# Altium schematic sheet eVV_Power Supply.SchDoc: eVV_Power Supply Block Diagram
size A4; DrawnBy: Ivica Matovic; Revision: 1.1; SheetNumber: 4; SheetTotal: 8
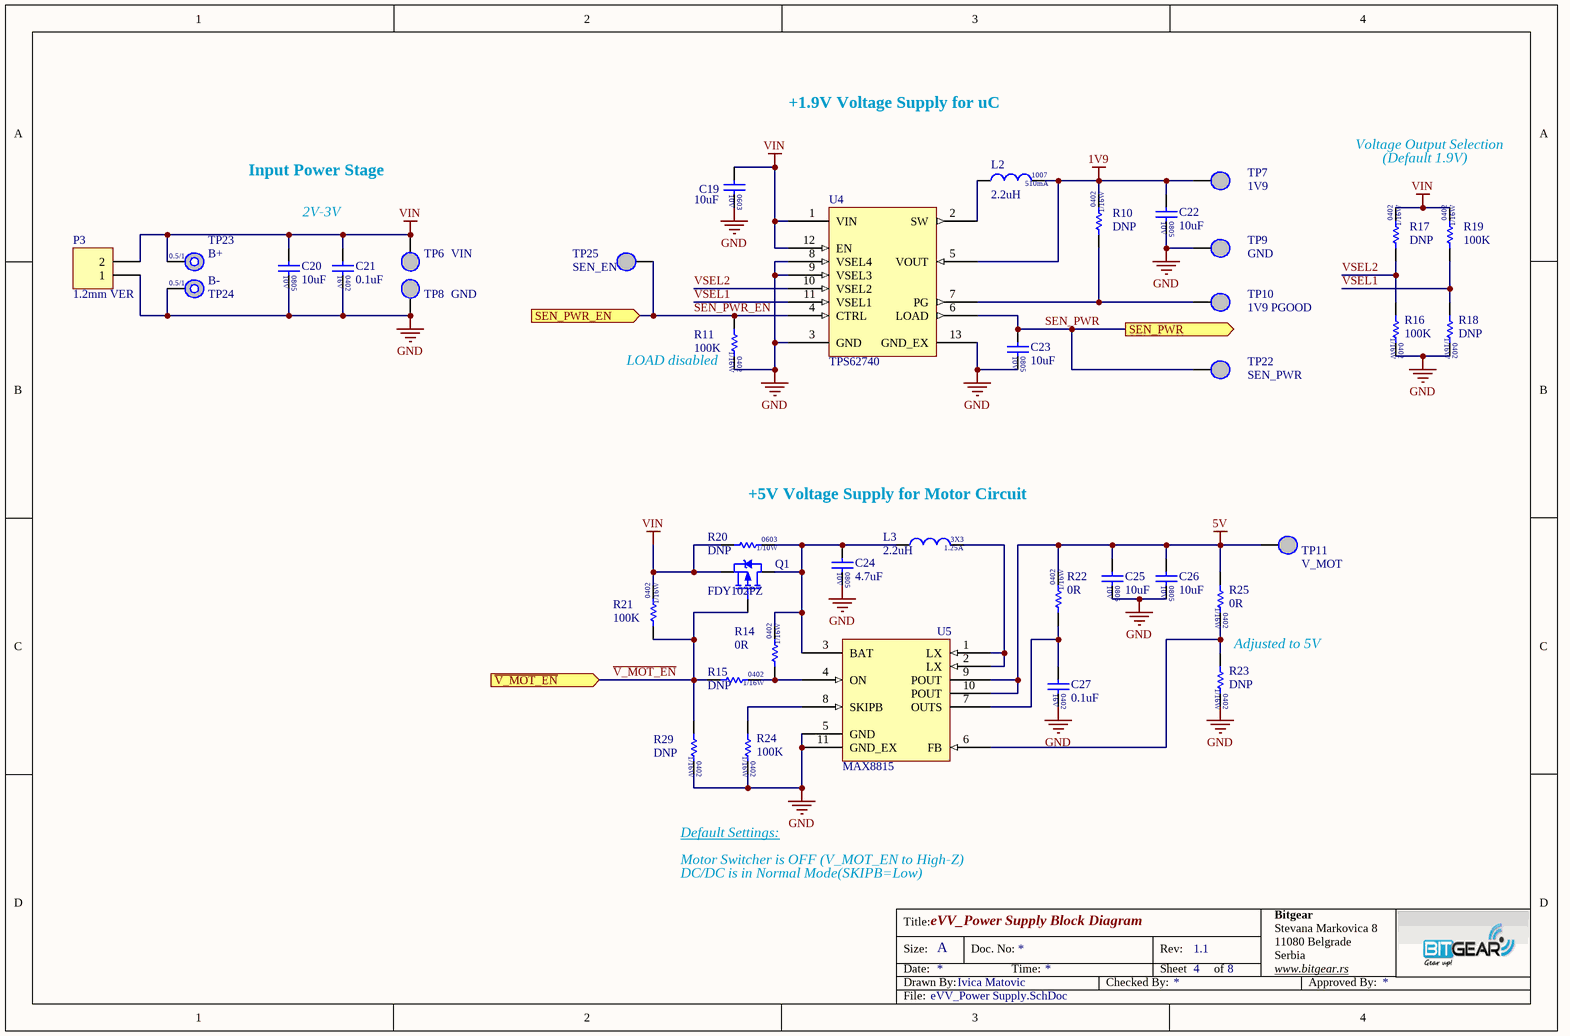
[diagram p0: eVV_Power Supply.SchDoc]

## Parts
C19  10uF  [CAPC1608X95N]
C20  10uF  [CAPC2012X145N]
C21  0.1uF  [CAPC1005X60N]
C22  10uF  [CAPC2012X145N]
C23  10uF  [CAPC2012X145N]
C24  4.7uF  [CAPC2012X145N]
C25  10uF  [CAPC2012X145N]
C26  10uF  [CAPC2012X145N]
C27  0.1uF  [CAPC1005X60N]
L2  2.2uH  [INDC2518X200N]
L3  2.2uH  [IND_3.0X3.0X1.5MM]
P3  1.2mm VER  [MOLEX_0781710002]
Q1  FDY102PZ  [SOT50P160X78-3N]
R10  DNP  [RESC1005X40AN]
R11  100K  [RESC1005X40AN]
R14  0R  [RESC1005X40AN]
R15  DNP  [RESC1005X40AN]
R16  100K  [RESC1005X40AN]
R17  DNP  [RESC1005X40AN]
R18  DNP  [RESC1005X40AN]
R19  100K  [RESC1005X40AN]
R20  DNP  [RESC1608X84N]
R21  100K  [RESC1005X40AN]
R22  0R  [RESC1005X40AN]
R23  DNP  [RESC1005X40AN]
R24  100K  [RESC1005X40AN]
R25  0R  [RESC1005X40AN]
R29  DNP  [RESC1005X40AN]
TP6  VIN  [TEST_POINT_1MM]  (no BOM)
TP7  1V9  [TEST_POINT_1MM]  (no BOM)
TP8  GND  [TEST_POINT_1MM]  (no BOM)
TP9  GND  [TEST_POINT_1MM]  (no BOM)
TP10  1V9 PGOOD  [TEST_POINT_1MM]  (no BOM)
TP11  V_MOT  [TEST_POINT_1MM]  (no BOM)
TP22  SEN_PWR  [TEST_POINT_1MM]  (no BOM)
TP23  B+  [TEST_POINT_TH_1MM]  (no BOM)
TP24  B-  [TEST_POINT_TH_1MM]  (no BOM)
TP25  SEN_EN  [TEST_POINT_1MM]  (no BOM)
U4  TPS62740  [SON50P200X300X80-12-TP]
U5  MAX8815  [TQFN50P300X300X80-10N-TP]

## Ports
SEN_PWR (out), SEN_PWR_EN (in), ~{V_MOT_EN} (in)

## Nets
1V9: C22.1 L2.2 R10.1 TP7.1 U4.5(VOUT)
5V: C25.1 C26.1 R22.1 R25.2 TP11.1 U5.9(POUT) U5.10(POUT)
GND: C19.2 C20.2 C21.2 C22.2 C23.2 C24.2 C25.2 C26.2 C27.2 P3.1 R11.1 R16.1 R18.1 R23.1 R24.1 R29.1 TP8.1 TP9.1 TP24.1 U4.3(GND) U4.8(VSEL4) U4.9(VSEL3) U4.13(GND_EX) U5.5(GND) U5.11(GND_EX)
VIN: C19.1 C20.1 C21.1 P3.2 Q1.2(S) R17.1 R19.1 R20.2 R21.1 TP6.1 TP23.1 U4.1(VIN) U4.12(EN)
~{V_MOT_EN}: Q1.1(G) R15.2 R21.2 R29.2 ; port ~{V_MOT_EN}
SEN_PWR: C23.1 TP22.1 U4.6(LOAD) ; port SEN_PWR
SEN_PWR_EN: R11.2 TP25.1 U4.4(CTRL) ; port SEN_PWR_EN
VSEL1: R18.2 R19.2 U4.11(VSEL1)
VSEL2: R16.2 R17.2 U4.10(VSEL2)
NetC24_1: C24.1 L3.1 Q1.3(D) R14.1 R20.1 U5.3(BAT)
NetC27_1: C27.1 R22.2 U5.7(OUTS)
NetL2_1: L2.1 U4.2(SW)
NetL3_2: L3.2 U5.1(LX) U5.2(LX)
NetR10_2: R10.2 TP10.1 U4.7(PG)
NetR14_2: R14.2 R15.1 U5.4(ON)
NetR23_2: R23.2 R25.1 U5.6(FB)
NetR24_2: R24.2 U5.8(SKIPB)

## Notes on the sheet
- +1.9V Voltage Supply for uC
- Input Power Stage
- Voltage Output Selection
- (Default 1.9V)
- 2V-3V
- (near R11) LOAD disabled
- +5V Voltage Supply for Motor Circuit
- Adjusted to 5V
- Default Settings:
- Motor Switcher is OFF (V_MOT_EN to High-Z)
- DC/DC is in Normal Mode(SKIPB=Low)
- Title:
- Bitgear
- Size:
- Date:
- Drawn By:
- A
- Doc. No:
- Time:
- Checked By:
- Sheet
- Rev:
- of
- Stevana Markovica 8
- 11080 Belgrade
- Serbia
- www.bitgear.rs
- Approved By:
- File:
- (in symbol Cap-1005 (0402) CER 0.1UF 16V X7R 10%) 16V
- (in symbol Cap-1608 (0603) CER 10uF 10V X5R 20%) 10V
- (in symbol Cap-2012 (0805) CER 4.7uF 10V X5R 10%) 10V
- (in symbol Cap-2012 (0805) CER 10uF 10V X5R 10%) 10V
- (in symbol Ind-3.0X3.0mm 2.2uH 1.25A 20%) 3X3; 1.25A
- (in symbol Ind-2518 (1007) 2.2uH 510mA 20%) 510mA
- (in symbol Res-1005 (0402) 0 Ohm 1/16W) 0402; 1/16W
- (in symbol Res-1005 (0402) 100 KOhm 1/16W 1%) 0402; 1/16W
- (in symbol Res-1005 (0402) 105 KOhm 1/16W 1%) 1/16W; 0402
- (in symbol Res-1608 (0603) 0 Ohm 1/10W) 0603; 1/10W
- (in symbol TP TH) 0.5/1

## Library data of the parts
C19 = Cap-1608 (0603) CER 10uF 10V X5R 20%: Capacitor Ceramic 10uF 1608 (0603) 10V X5R 20%; Manufacturer: Taiyo Yuden; D P/N: 587-3412-1-ND; D Price: 0.4; M P/N: LMK107BBJ106MAHT; S MOQ: 4000; S P/N: 587-3412-2-ND; S Price: 0.08296; Distributor: Digikey; Mounting: SM; Supplier: Digi Key; Package: 0603; Value: 10uF
C20 C22 C23 C25 C26 = Cap-2012 (0805) CER 10uF 10V X5R 10%: Capacitor Ceramic 10uF 2012 (0805) 10V X5R 10%; Manufacturer: TDK; D P/N: 445-7660-1-ND; D Price: 0.2; M P/N: C2012X5R1A106K125AB; S MOQ: 2000; S P/N: 445-7660-2-ND; S Price: 0.0363; Distributor: Digikey; Mounting: SM; Supplier: Digi Key; Package: 0805; Value: 10uF
C21 C27 = Cap-1005 (0402) CER 0.1UF 16V X7R 10%: CAP CER 0.1UF 0402 (1005) 16V X7R 10%; Manufacturer: Murata Electronics North America; D P/N: 490-3261-1-ND; D Price: 0.1; M P/N: GRM155R71C104KA88D; S MOQ: 10000; S P/N: 490-3261-2-ND; S Price: 0.00462; Distributor: Digikey; Mounting: SMD; Supplier: Digi Key; Package: 0402; Value: 0.1uF
C24 = Cap-2012 (0805) CER 4.7uF 10V X5R 10%: Capacitor Ceramic 4.7uF 2012 (0805) 10V X5R 10%; Manufacturer: Samsung Electro-Mechanics America; D P/N: 1276-1259-1-ND; D Price: 0.14; M P/N: CL21A475KPFNNNE; S MOQ: 2000; S P/N: 1276-1259-2-ND; S Price: 0.02256; Distributor: Digikey; Mounting: SM; Supplier: Digi Key; Package: 0805; Value: 4.7uF
L2 = Ind-2518 (1007) 2.2uH 510mA 20%: Inductor 2.2uH 510mA 20% 1007; Manufacturer: Taiyo Yuden; D P/N: 587-2244-1-ND; D Price: 0.14; M P/N: CB2518T2R2M; S MOQ: 2000; S P/N: 587-2244-2-ND; S Price: 0.051; Distributor: Digikey; Mounting: SMD; Supplier: Digi Key; Package: 1007; Value: 2.2uH
L3 = Ind-3.0X3.0mm 2.2uH 1.25A 20%: Inductor 2.2uH 1.25A 20% 3.0X3.0mm; Manufacturer: Murata Electronics North America; D P/N: 490-6639-1-ND; D Price: 0.43; M P/N: LQH3NPN2R2MM0L; S MOQ: 1000; S P/N: 490-6639-2-ND; S Price: 0.15462; Distributor: Digikey; Mounting: SMD; Supplier: Digi Key; Package: 1212; Value: 2.2uH
P3 = Connector MOLEX Pico-EZmate 1X2 1.2mm: 1.2mm pitch Pico-EZmate, Wire to Board, Vertical, with Locks, 1X2; Manufacturer: Molex; D P/N: WM4459CT-ND; D Price: 0.58; M P/N: 078171-0002; S MOQ: 1000; S Price: 0.297; Distributor: Digikey; Mounting: SMD; S P/N: WM4459CT-ND; Supplier: Digi Key; Value: 1X2
Q1 = FDY102PZ: P-MOSFET Single 0.83A Low Vgs; Manufacturer: Fairchild; D Price: 0.46; M P/N: FDY102PZCT-ND; S P/N: FDY102PZTR-ND; S Price: 0.08514; S MOQ: 3000; D P/N: FDY102PZ; Distributor: Digikey; Value: FDY102PZ; Mounting: SMD; Package: SC89-3; Supplier: Digi Key
R10 R17 R18 R29 = Res-1005 (0402) 100 KOhm 1/16W 1%: Manufacturer: Vishay Dale; D P/N: 311-100KLRCT-ND; D Price: 0.1; M P/N: RC0402FR-07100KL; S MOQ: 10000; S P/N: 311-100KLRTR-ND; S Price: 0.00152; Value: 100K; Distributor: Digikey; Mounting: SM; Supplier: Digi Key
R11 R16 R19 R21 R24 = Res-1005 (0402) 100 KOhm 1/16W 1%: Manufacturer: Vishay Dale; D P/N: 311-100KLRCT-ND; D Price: 0.1; M P/N: RC0402FR-07100KL; S MOQ: 10000; S P/N: 311-100KLRTR-ND; S Price: 0.00152; Distributor: Digikey; Mounting: SM; Supplier: Digi Key; Value: 100K
R14 R22 R25 = Res-1005 (0402) 0 Ohm 1/16W: Manufacturer: Stackpole Electronics Inc; D P/N: RMCF0402ZT0R00; D Price: 0.020; M P/N: RMCF0402ZT0R00CT-ND; S MOQ: 10000; S P/N: RMCF0402ZT0R00TR-ND; S Price: 0.00132; Distributor: Digikey; Mounting: SM; Supplier: Digi Key; Value: 0R
R15 = Res-1005 (0402) 0 Ohm 1/16W: Manufacturer: Stackpole Electronics Inc; D P/N: RMCF0402ZT0R00; D Price: 0.020; M P/N: RMCF0402ZT0R00CT-ND; S MOQ: 10000; S P/N: RMCF0402ZT0R00TR-ND; S Price: 0.00132; Value: 0R; Distributor: Digikey; Mounting: SM; Supplier: Digi Key
R20 = Res-1608 (0603) 0 Ohm 1/10W: Manufacturer: Samsung Electro-Mechanics America; D P/N: 1276-3510-1-ND; D Price: 0.1; M P/N: RC1608J000CS; S MOQ: 5000; S P/N: 1276-3510-2-ND; S Price: 0.00078; Value: 0R; Distributor: Digikey; Mounting: SM; Supplier: Digi Key
R23 = Res-1005 (0402) 105 KOhm 1/16W 1%: Manufacturer: Vishay Dale; D P/N: 541-105KLCT-ND; D Price: 0.083; M P/N: CRCW0402105KFKED; S MOQ: 10000; S P/N: 541-105KLTR-ND; S Price: 0.0054; Value: 105K; Distributor: Digikey; Mounting: SM; Supplier: Digi Key
TP6-TP11 TP22 TP25 = TP: Test point; D P/N: TESTP; D Price: 0; M P/N: TESTP; Mounting: SM
TP23 TP24 = TP TH: Test point Through Hole; D P/N: TESTP; D Price: 0; M P/N: TESTP; Mounting: SM
U4 = TPS62740: 360nA Iq Step Down Converter for Low Power Applications; Manufacturer: Texas Instruments; M P/N: TPS62740DSST; D P/N: 296-37134-1-ND; D Price: 2.2; S P/N: 296-37134-2-ND; S MOQ: 250; S Price: 2.1978; Mounting: SMD; Distributor: Digikey; Supplier: Digi Key
U5 = MAX8815: 100nA Iq Step Up Converter for Low Power Applications; Manufacturer: Maxim Integrated; M P/N: MAX8815AETB+T; D P/N: MAX8815AETB+TCT-ND; D Price: 2.98; S P/N: MAX8815AETB+TTR-ND; S MOQ: 2500; S Price: 1.34836; Mounting: SMD; Distributor: Digikey; Supplier: Digi Key